# EAGLE design XTIDE-CPLD-3V3-v2 (EAGLE 5.07)
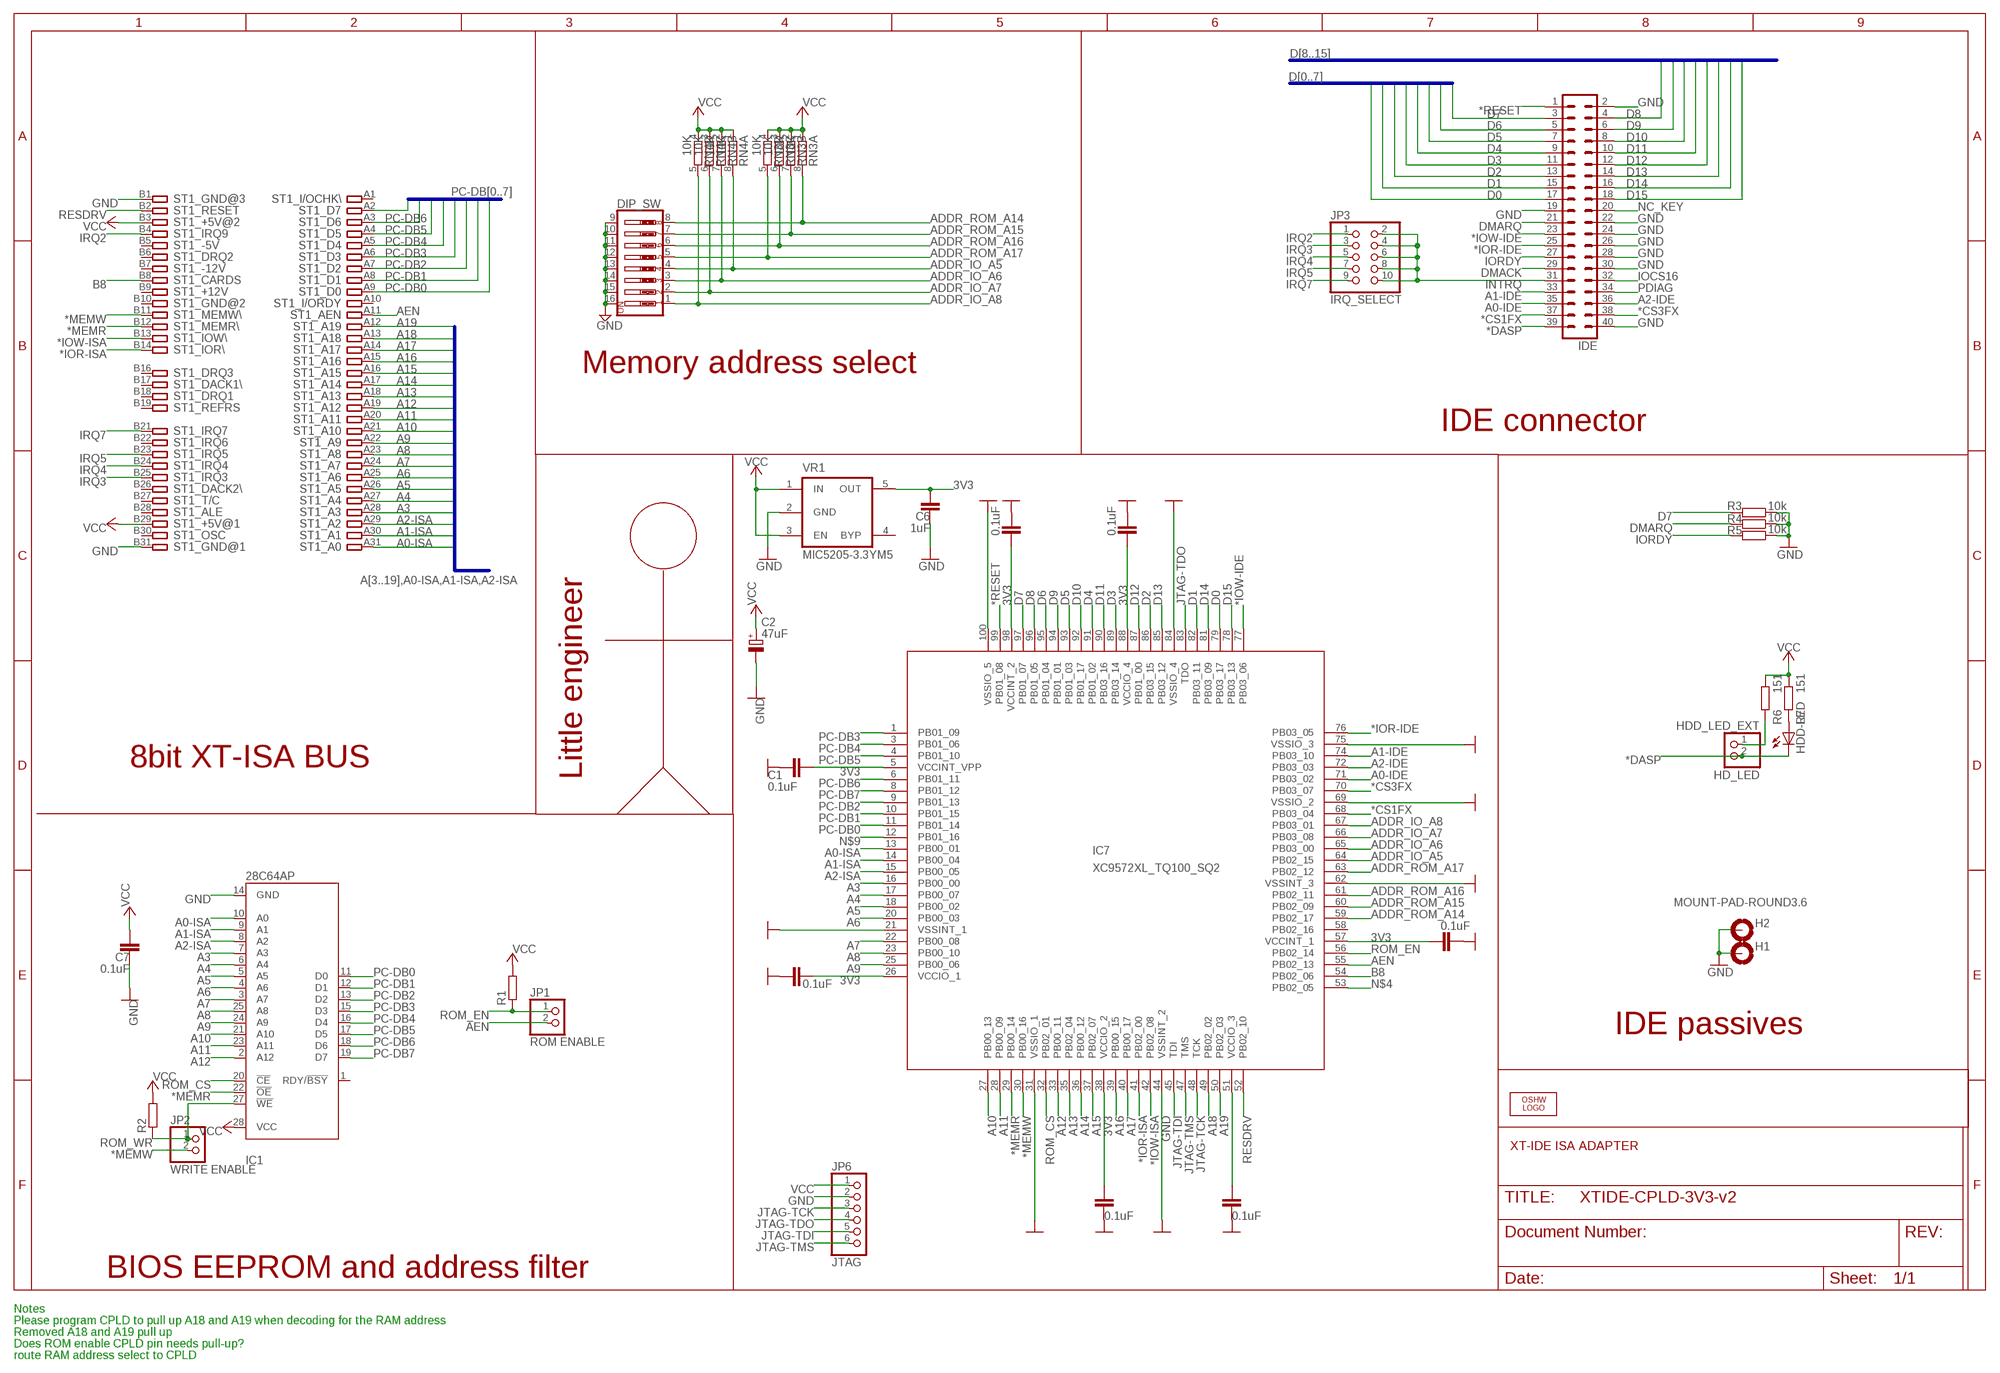
[diagram p0: schematic, sheet 1]

## Parts
C1  0.1uF  C-EUC0603  [C0603]
C2  47uF  CPOL-EUSANYO_SMD_A5  [SANYO-OSCON_SMD_A5]
C3  0.1uF  C-EUC0603  [C0603]
C4  0.1uF  C-EUC0603  [C0603]
C6  1uF  C-EUC0603  [C0603]
C7  0.1uF  C-EUC0603  [C0603]
C8  0.1uF  C-EUC0603  [C0603]
C9  0.1uF  C-EUC0603  [C0603]
C10  0.1uF  C-EUC0603  [C0603]
C11  0.1uF  C-EUC0603  [C0603]
DIP_SW  SW_DIP-8  [EDG-08]
H1  MOUNT-PAD-ROUND3.6  [3,6-PAD]
H2  MOUNT-PAD-ROUND3.6  [3,6-PAD]
HDD-LED  LEDCHIPLED_0805  [CHIPLED_0805]
HDD_LED_EXT  HD_LED  PINHD-1X02_2.54-S  [1X02-S]
IC1  28C64AP  [DIL28-6]
IC7  XC9572XL_TQ100_SQ2  [VQ100]
IDE  MA20-2  [MA20-2]
JP1  ROM ENABLE  PINHD-1X02_2.54-S  [1X02-S]
JP2  WRITE ENABLE  PINHD-1X02_2.54-S  [1X02-S]
JP3  IRQ_SELECT  PINHD-2X05_2.54  [2X05]
JP6  JTAG  PINHD-1X06_2.54-S  [1X06-S]
LOGO1  OSHW_LOGO_10MILX0200-NT  [OSHW_10X200_NOTEXT]
R1  R-EU_R0603  [R0603]
R2  R-EU_R0603  [R0603]
R3  10k  R-EU_R0603  [R0603]
R4  10k  R-EU_R0603  [R0603]
R5  10k  R-EU_R0603  [R0603]
R6  151  R-EU_R0603  [R0603]
R7  151  R-EU_R0603  [R0603]
RN3  10K  RNETWORK  [RN8P-4R-CRA06S]
RN4  10K  RNETWORK  [RN8P-4R-CRA06S]
ST1  IBM8BIT  [IBM8BIT]
VR1  MIC5205-3.3YM5  MIC5205  [SOT-23-5]

## Nets
3V3: C1.2 C3.2 C4.2 C6.2 C8.2 C9.2 C10.2 C11.2 IC7.5(VCCINT_VPP) IC7.26(VCCIO_1) IC7.38(VCCIO_2) IC7.51(VCCIO_3) IC7.57(VCCINT_1) IC7.88(VCCIO_4) IC7.98(VCCINT_2) VR1.5(OUT)
*CS1FX: IC7.68(PB03_04) IDE.37
*CS3FX: IC7.70(PB03_07) IDE.38
*DASP: HDD-LED.C HDD_LED_EXT.2 IDE.39
*IOR-IDE: IC7.76(PB03_05) IDE.25
*IOR-ISA: IC7.41(PB02_00) ST1.B14
*IOW-IDE: IC7.77(PB03_06) IDE.23
*IOW-ISA: IC7.42(PB02_08) ST1.B13
*MEMR: IC1.22(!OE) IC7.29(PB00_14) ST1.B12
*MEMW: IC7.30(PB00_16) JP2.2 ST1.B11
*RESET: IC7.99(PB01_08) IDE.1
A0-IDE: IC7.71(PB03_02) IDE.35
A0-ISA: IC1.10(A0) IC7.13(PB00_01) ST1.A31
A1-IDE: IC7.74(PB03_10) IDE.33
A1-ISA: IC1.9(A1) IC7.14(PB00_04) ST1.A30
A2-IDE: IC7.72(PB03_03) IDE.36
A2-ISA: IC1.8(A2) IC7.15(PB00_05) ST1.A29
A3: IC1.7(A3) IC7.16(PB00_00) ST1.A28
A4: IC1.6(A4) IC7.17(PB00_07) ST1.A27
A5: IC1.5(A5) IC7.18(PB00_02) ST1.A26
A6: IC1.4(A6) IC7.20(PB00_03) ST1.A25
A7: IC1.3(A7) IC7.22(PB00_08) ST1.A24
A8: IC1.25(A8) IC7.23(PB00_10) ST1.A23
A9: IC1.24(A9) IC7.25(PB00_06) ST1.A22
A10: IC1.21(A10) IC7.27(PB00_13) ST1.A21
A11: IC1.23(A11) IC7.28(PB00_09) ST1.A20
A12: IC1.2(A12) IC7.33(PB00_11) ST1.A19
A13: IC7.35(PB02_04) ST1.A18
A14: IC7.36(PB00_12) ST1.A17
A15: IC7.37(PB02_07) ST1.A16
A16: IC7.39(PB00_15) ST1.A15
A17: IC7.40(PB00_17) ST1.A14
A18: IC7.49(PB02_02) ST1.A13
A19: IC7.50(PB02_03) ST1.A12
ADDR_IO_A5: DIP_SW.4 IC7.64(PB02_15) RN4.8
ADDR_IO_A6: DIP_SW.3 IC7.65(PB03_00) RN4.7
ADDR_IO_A7: DIP_SW.2 IC7.66(PB03_08) RN4.6
ADDR_IO_A8: DIP_SW.1 IC7.67(PB03_01) RN4.5
ADDR_ROM_A14: DIP_SW.8 IC7.59(PB02_17) RN3.8
ADDR_ROM_A15: DIP_SW.7 IC7.60(PB02_09) RN3.7
ADDR_ROM_A16: DIP_SW.6 IC7.61(PB02_11) RN3.6
ADDR_ROM_A17: DIP_SW.5 IC7.63(PB02_12) RN3.5
AEN: IC7.55(PB02_13) JP1.2 ST1.A11
B8: IC7.54(PB02_06) ST1.B8
D0: IC7.79(PB03_17) IDE.17
D1: IC7.82(PB03_11) IDE.15
D2: IC7.86(PB03_15) IDE.13
D3: IC7.89(PB03_14) IDE.11
D4: IC7.91(PB01_02) IDE.9
D5: IC7.93(PB01_03) IDE.7
D6: IC7.95(PB01_04) IDE.5
D7: IC7.97(PB01_07) IDE.3 R3.2
D8: IC7.96(PB01_05) IDE.4
D9: IC7.94(PB01_01) IDE.6
D10: IC7.92(PB01_17) IDE.8
D11: IC7.90(PB03_16) IDE.10
D12: IC7.87(PB01_00) IDE.12
D13: IC7.85(PB03_12) IDE.14
D14: IC7.81(PB03_09) IDE.16
D15: IC7.78(PB03_13) IDE.18
DMACK: IDE.29
DMARQ: IDE.21 R4.2
GND: C1.1 C2.- C3.1 C4.1 C6.1 C7.1 C8.1 C9.1 C10.1 C11.1 DIP_SW.9 DIP_SW.10 DIP_SW.11 DIP_SW.12 DIP_SW.13 DIP_SW.14 DIP_SW.15 DIP_SW.16 H1.B3,6(MOUNT) H2.B3,6(MOUNT) IC1.14(GND) IC7.21(VSSINT_1) IC7.31(VSSIO_1) IC7.44(VSSINT_2) IC7.62(VSSINT_3) IC7.69(VSSIO_2) IC7.75(VSSIO_3) IC7.84(VSSIO_4) IC7.100(VSSIO_5) IDE.2 IDE.19 IDE.22 IDE.24 IDE.26 IDE.28 IDE.30 IDE.40 JP6.2 R3.1 R4.1 R5.1 ST1.B1 ST1.B31 VR1.2(GND)
INTRQ: IDE.31 JP3.2 JP3.4 JP3.6 JP3.8 JP3.10
IOCS16: IDE.32
IORDY: IDE.27 R5.2
IRQ2: JP3.1 ST1.B4
IRQ3: JP3.3 ST1.B25
IRQ4: JP3.5 ST1.B24
IRQ5: JP3.7 ST1.B23
IRQ7: JP3.9 ST1.B21
JTAG-TCK: IC7.48(TCK) JP6.3
JTAG-TDI: IC7.45(TDI) JP6.5
JTAG-TDO: IC7.83(TDO) JP6.4
JTAG-TMS: IC7.47(TMS) JP6.6
N$1: HDD-LED.A R7.2
N$4: IC7.53(PB02_05)
N$5: HDD_LED_EXT.1 R6.2
N$9: IC7.12(PB01_16)
NC_KEY: IDE.20
PC-DB0: IC1.11(D0) IC7.11(PB01_14) ST1.A9
PC-DB1: IC1.12(D1) IC7.10(PB01_15) ST1.A8
PC-DB2: IC1.13(D2) IC7.9(PB01_13) ST1.A7
PC-DB3: IC1.15(D3) IC7.1(PB01_09) ST1.A6
PC-DB4: IC1.16(D4) IC7.3(PB01_06) ST1.A5
PC-DB5: IC1.17(D5) IC7.4(PB01_10) ST1.A4
PC-DB6: IC1.18(D6) IC7.6(PB01_11) ST1.A3
PC-DB7: IC1.19(D7) IC7.8(PB01_12) ST1.A2
PDIAG: IDE.34
RESDRV: IC7.52(PB02_10) ST1.B2
ROM_CS: IC1.20(!CE) IC7.32(PB02_01)
ROM_EN: IC7.56(PB02_14) JP1.1 R1.1
ROM_WR: IC1.27(!WE) JP2.1 R2.1
VCC: C2.+ C7.2 IC1.28(VCC) JP6.1 R1.2 R2.2 R6.1 R7.1 RN3.1 RN3.2 RN3.3 RN3.4 RN4.1 RN4.2 RN4.3 RN4.4 ST1.B3 ST1.B29 VR1.1(IN) VR1.3(EN)
Unconnected: IC1.1(RDY/!BSY) IC7.58(PB02_16) ST1.A1 ST1.A10 ST1.B5 ST1.B6 ST1.B7 ST1.B9 ST1.B10 ST1.B15 ST1.B16 ST1.B17 ST1.B18 ST1.B19 ST1.B20 ST1.B22 ST1.B26 ST1.B27 ST1.B28 ST1.B30 VR1.4(BYP)

## Buses
D[0..7]
D[8..15]
PC-DB[0..7]
A[3..19],A0-ISA,A1-ISA,A2-ISA

## Notes on the sheet
- Memory address select
- IDE connector
- 8bit XT-ISA BUS
- Little engineer
- IDE passives
- XT-IDE ISA ADAPTER
- BIOS EEPROM and address filter
- Notes
- Please program CPLD to pull up A18 and A19 when decoding for the RAM address
- Removed A18 and A19 pull up
- Does ROM enable CPLD pin needs pull-up?
- route RAM address select to CPLD

## Library data of the parts
C1 C3 C4 C6-C11 = rcl:C-EU: CAPACITOR, European symbol
C2 = rcl:CPOL-EU: POLARIZED CAPACITOR, European symbol
DIP_SW = special:SW_DIP-8: DIP SWITCH
H1 H2 = holes:MOUNT-PAD-ROUND: MOUNTING PAD, round
HDD-LED = led:LED: LED OSRAM: - CHIPLED LG R971, LG N971, LY N971, LG Q971, LY Q971, LO R971, LY R971 LH N974, LH R974 LS Q976, LO Q976, LY Q976 LO Q996 - Hyper CHIPLED LW Q18S LB Q993, LB Q99A, LB R99A - SideLED LS A670, LO A670, LY A670, LG A670, LP A670 LB A673, LV A673, LT A673, LW A673 LH A674 LY A675 LS A676, LA A676, LO A676, LY A676, LW A676 LS A679, LY A679, LG A679 - Hyper Micro SIDELED® LS Y876, LA Y876, LO Y876, LY Y876 LT Y87S - SmartLED LW L88C, LW L88S LB L89C, LB L89S, LG L890 LS L89K, LO L89K, LY L89K LS L896, LA L896, LO L896, LY L896 - TOPLED LS T670, LO T670, LY T670, LG T670, LP T670 LSG T670, LSP T670, LSY T670, LOP T670, LYG T670 LG T671, LOG T671, LSG T671 LB T673, LV T673, LT T673, LW T673 LH T674 LS T676, LA T676, LO T676, LY T676, LB T676, LH T676, LSB T676, LW T676 LB T67C, LV T67C, LT T67C, LS T67K, LO T67K, LY T67K, LW E67C LS E67B, LA E67B, LO E67B, LY E67B, LB E67C, LV E67C, LT E67C LW T67C LS T679, LY T679, LG T679 LS T770, LO T770, LY T770, LG T770, LP T770 LB T773, LV T773, LT T773, LW T773 LH T774 LS E675, LA E675, LY E675, LS T675 LS T776, LA T776, LO T776, LY T776, LB T776 LHGB T686 LT T68C, LB T68C - Hyper Mini TOPLED® LB M676 - Mini TOPLED Santana® LG M470 LS M47K, LO M47K, LY M47K Source: http://www.osram.convergy.de LUXEON: - LUMILED® LXK2-PW12-R00, LXK2-PW12-S00, LXK2-PW14-U00, LXK2-PW14-V00 LXK2-PM12-R00, LXK2-PM12-S00, LXK2-PM14-U00 LXK2-PE12-Q00, LXK2-PE12-R00, LXK2-PE12-S00, LXK2-PE14-T00, LXK2-PE14-U00 LXK2-PB12-K00, LXK2-PB12-L00, LXK2-PB12-M00, LXK2-PB14-N00, LXK2-PB14-P00, LXK2-PB14-Q00 LXK2-PR12-L00, LXK2-PR12-M00, LXK2-PR14-Q00, LXK2-PR14-R00 LXK2-PD12-Q00, LXK2-PD12-R00, LXK2-PD12-S00 LXK2-PH12-R00, LXK2-PH12-S00 LXK2-PL12-P00, LXK2-PL12-Q00, LXK2-PL12-R00 Source: www.luxeon.com KINGBRIGHT: KA-3528ASYC Source: www.kingbright.com
HDD_LED_EXT JP1 JP2 = pinhead-2:PINHD-1X02: PIN HEADER
IC1 = microchip:28*64A: CMOS EEPROM 64 K (8 K x 8), low voltage
IC7 = dp_devices:XC9572XL_TQ100_SQ2: xc9572xl_tq100 edit this description Auto generated by make-symbol-device-package-bsdl.ulp Rev. 34 Source: xc9572xl_tq100.bsd
IDE = con-lstb:MA20-2: PIN HEADER
JP3 = pinhead-2:PINHD-2X05: PIN HEADER
JP6 = pinhead-2:PINHD-1X06: PIN HEADER
LOGO1 = ohw-logo:OSHW_LOGO_10MIL
R1-R7 = rcl:R-EU_: RESISTOR, European symbol
RN3 RN4 = dp_devices:RNETWORK: 4 Resistor Array 0603
ST1 = con-pc:IBM8BIT: 8-bit CARD IBM/PC-AT
VR1 = dp_devices:MIC5205: 150ma Low-Noise LDO Regulator

## Board
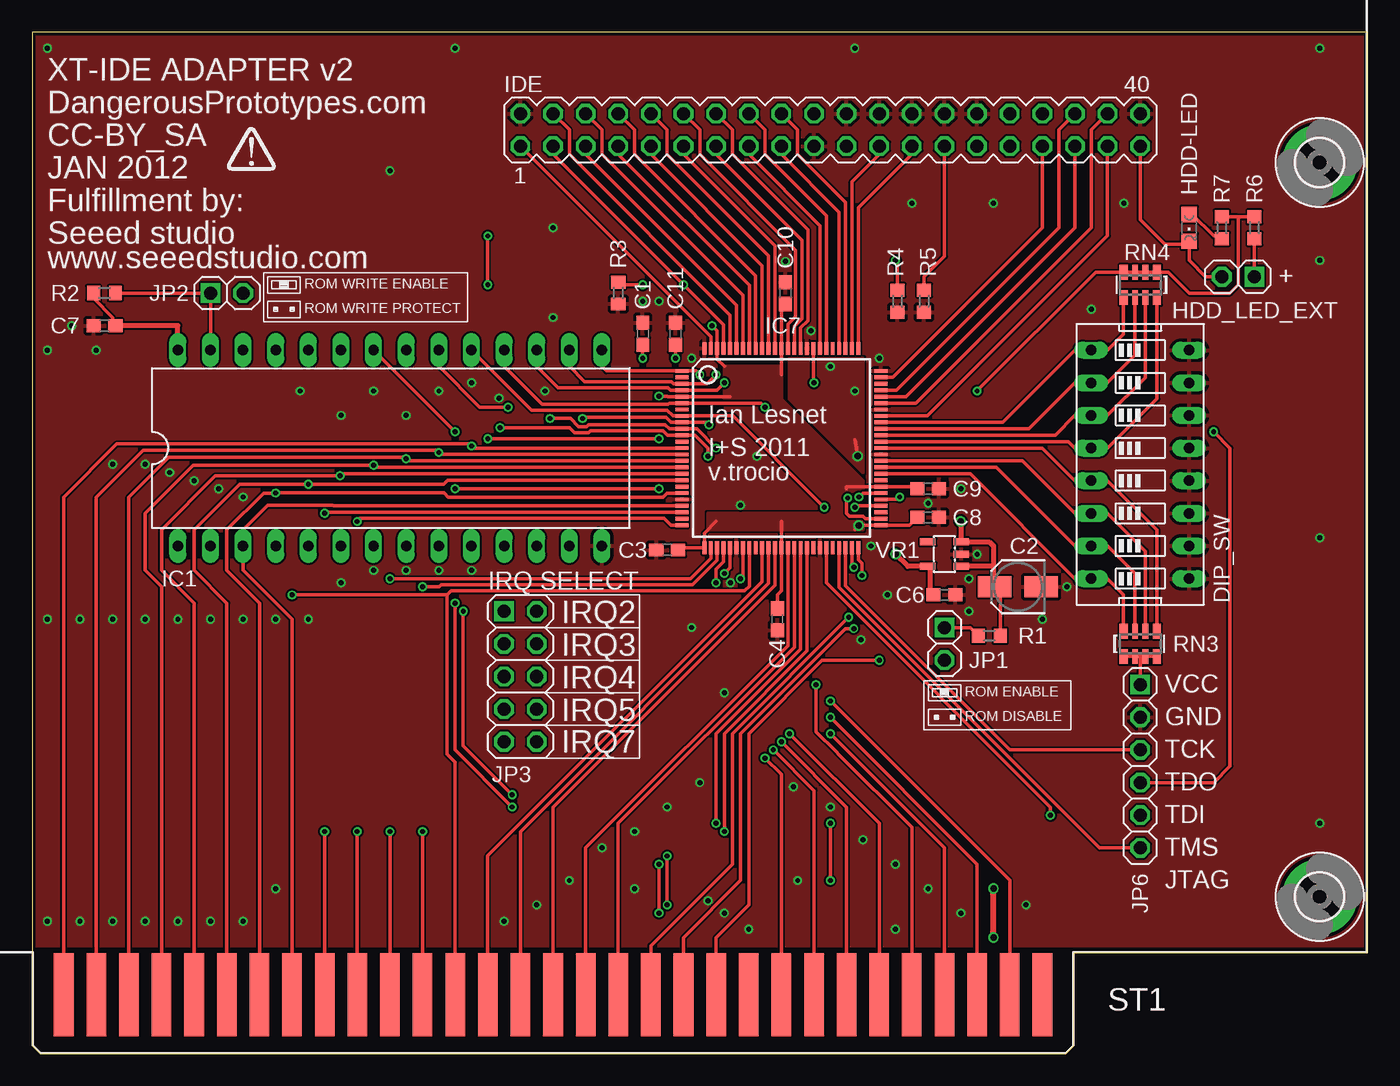
[diagram p1: board, top side]
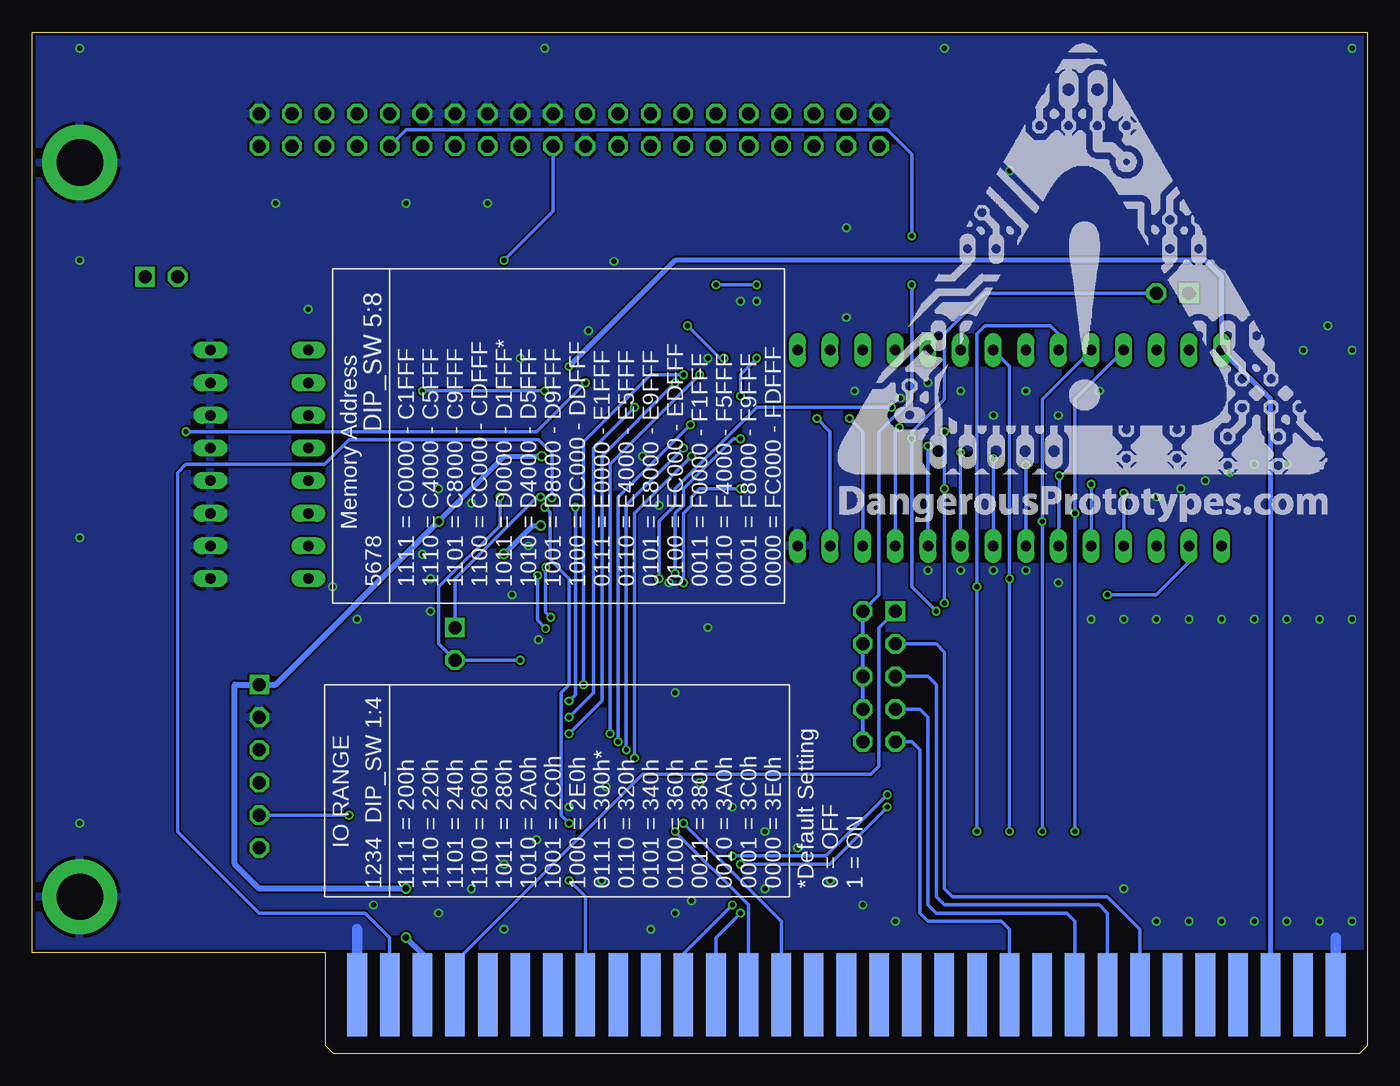
[diagram p2: board, bottom side, seen from below]

Size 103.97 x 79.52 mm. Coordinates in mm from the lower left corner, seen from the top.
Outline: 0,0.79 0,0.63 0.63,0 80.49,0 81.12,0.63 81.12,7.86 103.97,7.86 103.97,79.52 0,79.52 0,0.79
Copper layers (1*16): Top 0.035mm / dielectric 1.5mm / Bottom 0.035mm
Design rules "Fusion_eagle_rule_v1.1": minimum track width 6mil, minimum drill 12mil, track to track 6mil, track to pad 6mil, pad to pad 6mil, via to via 6mil, smd to smd 0mil, copper to edge 10mil, drill to drill 10mil, minimum pad ring 10mil, minimum via ring 6mil, stop-mask expansion 2mil, vias tented up to drill 100mil, thermal gap 10mil

### Footprints (pad centres in the part's own frame; a part is rotated, then mirrored left to right if it is on the bottom)
C0603 = smd 1.1 x 1: 1 -0.85,0; 2 0.85,0
SANYO-OSCON_SMD_A5 = smd 2.6 x 1.6: + 1.8,0; - -1.8,0
EDG-08 = drill 0.813 long: 1 -8.89,-3.81; 2 -6.35,-3.81; 3 -3.81,-3.81; 4 -1.27,-3.81; 5 1.27,-3.81; 6 3.81,-3.81; 7 6.35,-3.81; 8 8.89,-3.81; 9 8.89,3.81; 10 6.35,3.81; 11 3.81,3.81; 12 1.27,3.81; 13 -1.27,3.81; 14 -3.81,3.81; 15 -6.35,3.81; 16 -8.89,3.81
3,6-PAD = drill 3.6 pad 5.842 round: B3,6 0,0
CHIPLED_0805 = smd 1.2 x 1.2: A 0,-1.05; C 0,1.05
1X02-S = drill 1.016 square: 1 -1.27,0 | drill 1.016 octagon: 2 1.27,0
DIL28-6 = drill 0.813 long: 1 -16.51,-7.62; 2 -13.97,-7.62; 3 -11.43,-7.62; 4 -8.89,-7.62; 5 -6.35,-7.62; 6 -3.81,-7.62; 7 -1.27,-7.62; 8 1.27,-7.62; 9 3.81,-7.62; 10 6.35,-7.62; 11 8.89,-7.62; 12 11.43,-7.62; 13 13.97,-7.62; 14 16.51,-7.62; 15 16.51,7.62; 16 13.97,7.62; 17 11.43,7.62; 18 8.89,7.62; 19 6.35,7.62; 20 3.81,7.62; 21 1.27,7.62; 22 -1.27,7.62; 23 -3.81,7.62; 24 -6.35,7.62; 25 -8.89,7.62; 26 -11.43,7.62; 27 -13.97,7.62; 28 -16.51,7.62
VQ100 = smd 1 x 0.3: 1 -7.75,6; 2 -7.75,5.5; 3 -7.75,5; 4 -7.75,4.5; 5 -7.75,4; 6 -7.75,3.5; 7 -7.75,3; 8 -7.75,2.5; 9 -7.75,2; 10 -7.75,1.5; 11 -7.75,1; 12 -7.75,0.5; 13 -7.75,0; 14 -7.75,-0.5; 15 -7.75,-1; 16 -7.75,-1.5; 17 -7.75,-2; 18 -7.75,-2.5; 19 -7.75,-3; 20 -7.75,-3.5; 21 -7.75,-4; 22 -7.75,-4.5; 23 -7.75,-5; 24 -7.75,-5.5; 25 -7.75,-6; 51 7.75,-6; 52 7.75,-5.5; 53 7.75,-5; 54 7.75,-4.5; 55 7.75,-4; 56 7.75,-3.5; 57 7.75,-3; 58 7.75,-2.5; 59 7.75,-2; 60 7.75,-1.5; 61 7.75,-1; 62 7.75,-0.5; 63 7.75,0; 64 7.75,0.5; 65 7.75,1; 66 7.75,1.5; 67 7.75,2; 68 7.75,2.5; 69 7.75,3; 70 7.75,3.5; 71 7.75,4; 72 7.75,4.5; 73 7.75,5; 74 7.75,5.5; 75 7.75,6 | smd 0.3 x 1: 26 -6,-7.75; 27 -5.5,-7.75; 28 -5,-7.75; 29 -4.5,-7.75; 30 -4,-7.75; 31 -3.5,-7.75; 32 -3,-7.75; 33 -2.5,-7.75; 34 -2,-7.75; 35 -1.5,-7.75; 36 -1,-7.75; 37 -0.5,-7.75; 38 0,-7.75; 39 0.5,-7.75; 40 1,-7.75; 41 1.5,-7.75; 42 2,-7.75; 43 2.5,-7.75; 44 3,-7.75; 45 3.5,-7.75; 46 4,-7.75; 47 4.5,-7.75; 48 5,-7.75; 49 5.5,-7.75; 50 6,-7.75; 76 6,7.75; 77 5.5,7.75; 78 5,7.75; 79 4.5,7.75; 80 4,7.75; 81 3.5,7.75; 82 3,7.75; 83 2.5,7.75; 84 2,7.75; 85 1.5,7.75; 86 1,7.75; 87 0.5,7.75; 88 0,7.75; 89 -0.5,7.75; 90 -1,7.75; 91 -1.5,7.75; 92 -2,7.75; 93 -2.5,7.75; 94 -3,7.75; 95 -3.5,7.75; 96 -4,7.75; 97 -4.5,7.75; 98 -5,7.75; 99 -5.5,7.75; 100 -6,7.75
MA20-2 = drill 1.016 octagon: 1 -24.13,-1.27; 2 -24.13,1.27; 3 -21.59,-1.27; 4 -21.59,1.27; 5 -19.05,-1.27; 6 -19.05,1.27; 7 -16.51,-1.27; 8 -16.51,1.27; 9 -13.97,-1.27; 10 -13.97,1.27; 11 -11.43,-1.27; 12 -11.43,1.27; 13 -8.89,-1.27; 14 -8.89,1.27; 15 -6.35,-1.27; 16 -6.35,1.27; 17 -3.81,-1.27; 18 -3.81,1.27; 19 -1.27,-1.27; 20 -1.27,1.27; 21 1.27,-1.27; 22 1.27,1.27; 23 3.81,-1.27; 24 3.81,1.27; 25 6.35,-1.27; 26 6.35,1.27; 27 8.89,-1.27; 28 8.89,1.27; 29 11.43,-1.27; 30 11.43,1.27; 31 13.97,-1.27; 32 13.97,1.27; 33 16.51,-1.27; 34 16.51,1.27; 35 19.05,-1.27; 36 19.05,1.27; 37 21.59,-1.27; 38 21.59,1.27; 39 24.13,-1.27; 40 24.13,1.27
2X05 = drill 1.016 square: 1 -5.08,-1.27 | drill 1.016 octagon: 2 -5.08,1.27; 3 -2.54,-1.27; 4 -2.54,1.27; 5 0,-1.27; 6 0,1.27; 7 2.54,-1.27; 8 2.54,1.27; 9 5.08,-1.27; 10 5.08,1.27
1X06-S = drill 1.016 square: 1 -6.35,0 | drill 1.016 octagon: 2 -3.81,0; 3 -1.27,0; 4 1.27,0; 5 3.81,0; 6 6.35,0
R0603 = smd 1 x 1.1: 1 -0.85,0; 2 0.85,0
RN8P-4R-CRA06S = smd 0.63 x 1.15: 1 -1.295,-0.975; 4 1.295,-0.975; 5 1.295,0.975; 8 -1.295,0.975 | smd 0.44 x 1.15: 2 -0.4,-0.975; 3 0.4,-0.975; 6 0.4,0.975; 7 -0.4,0.975
IBM8BIT = smd 1.524 x 6.477: A1 -25.4,5.08; A2 -27.94,5.08; A3 -30.48,5.08; A4 -33.02,5.08; A5 -35.56,5.08; A6 -38.1,5.08; A7 -40.64,5.08; A8 -43.18,5.08; A9 -45.72,5.08; A10 -48.26,5.08; A11 -50.8,5.08; A12 -53.34,5.08; A13 -55.88,5.08; A14 -58.42,5.08; A15 -60.96,5.08; A16 -63.5,5.08; A17 -66.04,5.08; A18 -68.58,5.08; A19 -71.12,5.08; A20 -73.66,5.08; A21 -76.2,5.08; A22 -78.74,5.08; A23 -81.28,5.08; A24 -83.82,5.08; A25 -86.36,5.08; A26 -88.9,5.08; A27 -91.44,5.08; A28 -93.98,5.08; A29 -96.52,5.08; A30 -99.06,5.08; A31 -101.6,5.08 | smd 1.524 x 6.477 bottom: B1 -25.4,5.08; B2 -27.94,5.08; B3 -30.48,5.08; B4 -33.02,5.08; B5 -35.56,5.08; B6 -38.1,5.08; B7 -40.64,5.08; B8 -43.18,5.08; B9 -45.72,5.08; B10 -48.26,5.08; B11 -50.8,5.08; B12 -53.34,5.08; B13 -55.88,5.08; B14 -58.42,5.08; B15 -60.96,5.08; B16 -63.5,5.08; B17 -66.04,5.08; B18 -68.58,5.08; B19 -71.12,5.08; B20 -73.66,5.08; B21 -76.2,5.08; B22 -78.74,5.08; B23 -81.28,5.08; B24 -83.82,5.08; B25 -86.36,5.08; B26 -88.9,5.08; B27 -91.44,5.08; B28 -93.98,5.08; B29 -96.52,5.08; B30 -99.06,5.08; B31 -101.6,5.08
SOT-23-5 = smd 0.55 x 1.2: 1 -0.95,-1.3; 2 0,-1.3; 3 0.95,-1.3; 4 0.95,1.3; 5 -0.95,1.3

### Placement (x,y rotation side)
C1  47.55,56.04 270 top
C2  76.76,36.35 180 top
C3  49.45,39.21 0 top
C4  58.02,33.81 90 top
C6  71.04,35.72 180 top
C7  5.64,56.67 0 top
C8  69.77,41.75 180 top
C9  69.77,43.97 180 top
C10  58.66,59.21 270 top
C11  50.09,56.04 270 top
DIP_SW  86.28,45.88 270 top
H1  100.25,12.22 0 top
H2  100.25,69.37 0 top
HDD-LED  90.09,64.29 180 top
HDD_LED_EXT  93.9,60.48 180 top
IC1  27.86,47.15 0 top
IC7  58.34,47.15 0 top
IDE  62.15,71.91 0 top
JP1  71.04,31.91 270 top
JP2  15.16,59.21 0 top
JP3  38.02,29.37 270 top
JP6  86.28,22.38 270 top
R1  74.53,32.54 0 top
R2  5.64,59.21 180 top
R3  45.64,59.21 90 top
R4  67.39,58.58 90 top
R5  69.45,58.58 90 top
R6  95.17,64.29 270 top
R7  92.63,64.29 270 top
RN3  86.28,31.91 0 top
RN4  86.28,59.85 180 top
ST1  104.06,-0.48 0 top
U$1  [DP-LOGO_TOP]  15.16,68.74 0 top
U$3  [JUMP2_DESC_ON]  19.61,59.85 0 top
U$4  [JUMP2_DESC_OFF]  19.61,57.94 0 top
U$5  [DP_LOGO_ART_1.5X1.5]  41.2,41.43 0 bottom
U$6  [JUMP2_DESC_ON]  71.04,28.1 0 top
U$7  [JUMP2_DESC_OFF]  71.04,26.19 0 top
VR1  71.04,38.89 90 top

### Tracks (layer width: path | path; a pad name or v marks a point on that pad's centre or on a via)
3V3  (via drill 0.38, 0.51)
  Top 0.254: 53.9,53.5 53.34,54.05 IC7.98 53.34,56.28 v52.94,56.67 | 54.34,51.15 IC7.5 49.5,51.15 49.45,51.2 v48.82,51.2 | C11.2 v50.09,54.13 | C1.2 v47.55,54.13 | 58.34,41.43 IC7.38 58.34,36.04 58.02,35.72 C4.2 | 64.06,40.8 64.41,41.15 IC7.51 68.32,41.15 C8.2 68.82,41.75 | 53.26,41.43 52.34,40.51 IC7.26 50.49,39.4 C3.2 | 63.42,43.97 63.42,44.15 IC7.57 68.75,44.15 C9.2 | 58.34,52.86 IC7.88 58.34,58.05 C10.2
  Top 0.406: v67.23,38.89 68.18,37.94 VR1.5 69.93,37.75 69.93,35.72 C6.2
  Bottom 0.254: v50.09,54.13 50.4,54.13 v52.94,56.67 | v48.82,51.2 48.82,52.86 v47.55,54.13
  Bottom 0.406: v67.23,38.89 65.01,41.12 v64.37,41.12
  pour Top: 53.9,53.5 58.34,53.5 58.34,50.96 64.69,44.61 64.69,40.8 52.63,40.8 52.63,42.07 61.52,42.07 61.52,42.7 53.9,50.32
*CS1FX
  Top 0.254: IC7.68 69.73,49.65 83.74,63.66 IDE.37
*CS3FX
  Top 0.254: IDE.38 82.47,71.91 82.47,64.29 68.83,50.65 IC7.70
*DASP
  Top 0.254: IDE.39 86.28,64.93 88.19,63.02 89.87,63.02 HDD-LED.C 90.09,61.75 91.36,60.48 HDD_LED_EXT.2
*IOR-IDE
  Top 0.254: IC7.76 64.34,65.85 68.5,70.01 IDE.25
*IOR-ISA  (via drill 0.38)
  Top 0.254: IC7.41 59.84,31.5 53.26,24.92 v53.26,17.94
  Bottom 0.254: ST1.B14 45.64,10.32 v53.26,17.94
*IOW-IDE
  Top 0.254: IC7.77 63.84,67.89 65.96,70.01 IDE.23
*IOW-ISA  (via drill 0.38)
  Top 0.254: IC7.42 60.34,31.37 53.9,24.92 v53.9,17.3
  Bottom 0.254: ST1.B13 48.18,11.59 v53.9,17.3
*MEMR  (via drill 0.38)
  Top 0.254: v32.94,48.42 IC1.22 | v32.94,35.08 32.94,23.65 v37.39,19.21 | v48.82,14.76 v48.82,10.95 | v32.94,43.97 v48.82,43.97 | v53.26,36.67 53.26,37.7 53.84,38.28 IC7.29
  Bottom 0.254: v32.94,35.08 v32.94,43.97 v32.94,48.42 | v48.82,10.95 50.72,9.05 ST1.B12 | v48.82,14.76 41.83,14.76 v37.39,19.21 | 51.99,43.97 | v48.82,43.97 51.99,43.97 | 51.99,43.97 52.63,43.34 52.63,42.7 53.26,42.07 v53.26,36.67
*MEMW  (via drill 0.38)
  Top 0.254: v49.45,15.4 v49.45,11.59 | v33.58,34.45 33.58,23.97 v37.39,20.16 | v35.48,47.86 v48.82,47.86 | IC7.30 54.34,37.83 v53.9,37.39
  Bottom 0.254: JP2.2 29.77,59.21 32.94,56.04 32.94,50.96 35.48,48.42 v35.48,47.86 35.48,36.35 v33.58,34.45 | ST1.B11 53.26,7.78 v49.45,11.59 | v49.45,15.4 42.15,15.4 v37.39,20.16 | v48.82,47.86 49.37,47.86 53.26,43.97 53.26,42.7 53.9,42.07 v53.9,37.39
*RESET
  Top 0.254: IC7.99 52.84,55.82 IDE.1
A0-IDE
  Top 0.254: IC7.71 68.06,51.15 81.2,64.29 IDE.35
A0-ISA  (via drill 0.38)
  Top 0.254: IC7.13 34.37,47.15 v34.21,47.31 | v34.21,47.31 | v34.21,47.31 34.05,47.47 6.59,47.47 2.46,43.34 ST1.A31
  Bottom 0.254: v34.21,47.31 IC1.10
A1-IDE
  Top 0.254: IDE.33 78.66,64.29 67.02,52.65 IC7.74
A1-ISA  (via drill 0.38)
  Top 0.254: IC7.14 31.83,46.65 v31.67,46.81 31.49,46.99 8.65,46.99 5,43.34 ST1.A30
  Bottom 0.254: v31.67,46.81 IC1.9
A2-IDE
  Top 0.254: IDE.36 79.93,71.91 79.93,64.29 67.29,51.65 IC7.72
A2-ISA  (via drill 0.38)
  Top 0.254: IC7.15 29.29,46.15 v29.13,46.31 29,46.43 10.64,46.43 7.54,43.34 ST1.A29
  Bottom 0.254: v29.13,46.31 IC1.8
A3  (via drill 0.38)
  Top 0.254: ST1.A28 10.08,36.35 8.81,37.62 8.81,42.07 12.55,45.81 v26.59,45.81 26.75,45.65 IC7.16
  Bottom 0.254: v26.59,45.81 IC1.7
A4  (via drill 0.38)
  Top 0.254: ST1.A27 12.62,35.08 10.08,37.62 10.08,40.8 14.27,44.99 v23.97,44.99 24.13,45.15 IC7.17
  Bottom 0.254: v23.97,44.99 IC1.6
A5  (via drill 0.38)
  Top 0.254: ST1.A26 15.16,35.08 12.62,37.62 12.62,40.8 16.15,44.33 v21.51,44.33 32.03,44.33 32.35,44.65 IC7.18
  Bottom 0.254: v21.51,44.33 IC1.5
A6  (via drill 0.38)
  Top 0.254: ST1.A25 17.7,35.08 15.16,37.62 15.16,40.8 18.01,43.65 v18.97,43.65 18.98,43.66 32.07,43.66 32.38,43.34 49.13,43.34 49.44,43.65 IC7.20
  Bottom 0.254: v18.97,43.65 IC1.4
A7
  Top 0.254: ST1.A24 20.24,33.81 16.43,37.62 IC1.3 16.43,40.8 18.34,42.7 23.42,42.7 23.47,42.65 IC7.22
A8  (via drill 0.38)
  Top 0.254: ST1.A23 v22.78,17.3 | IC7.23 22.86,42.15 v22.78,42.07
  Bottom 0.254: v22.78,17.3 v22.78,42.07 22.78,50.96 IC1.25
A9  (via drill 0.38)
  Top 0.254: ST1.A22 v25.32,17.3 | IC7.25 49.74,41.15 49.45,41.43 | 49.45,41.43 | 49.29,41.59 49.45,41.43 | 49.29,41.59 | 49.29,41.59 49.21,41.67 25.56,41.67 v25.32,41.43
  Bottom 0.254: v25.32,17.3 v25.32,41.43 25.32,50.96 IC1.24
A10  (via drill 0.38)
  Top 0.254: ST1.A21 v27.86,17.3 | IC7.27 52.84,38.55 51.28,36.99 v27.86,36.99
  Bottom 0.254: v27.86,17.3 v27.86,36.99 27.86,53.5 IC1.21
A11  (via drill 0.38)
  Top 0.254: ST1.A20 v30.4,17.3 | IC7.28 53.34,38.42 51.43,36.51 31.83,36.51 31.67,36.35 v30.4,36.35
  Bottom 0.254: v30.4,17.3 v30.4,36.35 30.4,56.04 29.77,56.67 24.69,56.67 24.05,56.04 IC1.23
A12  (via drill 0.38)
  Top 0.254: IC7.33 55.84,36.39 55.48,36.04 32.62,36.04 32.31,35.72 | ST1.A19 32.94,22.7 32.31,23.34 32.31,35.72 | 32.31,35.72 v20.24,35.72 | 32.31,35.72
  Bottom 0.254: IC1.2 13.89,38.26 16.43,35.72 v20.24,35.72
A13
  Top 0.254: IC7.35 56.84,36.76 35.48,15.4 ST1.A18
A14
  Top 0.254: IC7.36 57.34,36.62 38.02,17.3 ST1.A17
A15
  Top 0.254: IC7.37 57.84,36.49 40.56,19.21 ST1.A16
A16
  Top 0.254: ST1.A15 43.1,16.03 58.84,31.77 IC7.39
A17
  Top 0.254: ST1.A14 45.64,17.94 59.34,31.64 IC7.40
A18  (via drill 0.38)
  Top 0.254: v63.58,33.97 54.53,24.92 54.53,14.76 48.18,8.41 ST1.A13 | IC7.49 63.84,38 v63.98,37.86
  Bottom 0.254: v63.98,37.86 63.98,34.37 v63.58,33.97
A19  (via drill 0.38)
  Top 0.254: ST1.A12 50.72,9.05 55.17,13.49 55.17,24.92 63.34,33.1 v63.98,33.1 | IC7.50 64.34,38.45 64.61,38.18 v64.61,37.23
  Bottom 0.254: v64.61,37.23 64.61,33.73 v63.98,33.1
ADDR_IO_A5
  Top 0.254: RN4.8 87.58,50.98 83.74,47.15 DIP_SW.4 81.2,47.15 80.7,47.65 IC7.64
ADDR_IO_A6
  Top 0.254: RN4.7 86.68,52.63 83.74,49.69 DIP_SW.3 81.2,49.69 79.66,48.15 IC7.65
ADDR_IO_A7
  Top 0.254: RN4.6 85.88,54.37 83.74,52.23 DIP_SW.2 81.2,52.23 77.62,48.65 IC7.66
ADDR_IO_A8
  Top 0.254: RN4.5 84.99,56.01 83.74,54.77 DIP_SW.1 81.2,54.77 75.58,49.15 IC7.67
ADDR_ROM_A14
  Top 0.254: RN3.8 84.99,35.74 83.74,36.99 DIP_SW.8 81.2,36.99 73.04,45.15 IC7.59
ADDR_ROM_A15
  Top 0.254: RN3.7 85.88,37.39 83.74,39.53 DIP_SW.7 81.2,39.53 75.08,45.65 IC7.60
ADDR_ROM_A16
  Top 0.254: RN3.6 86.68,39.13 83.74,42.07 DIP_SW.6 81.2,42.07 77.12,46.15 IC7.61
ADDR_ROM_A17
  Top 0.254: RN3.5 87.58,40.77 83.74,44.61 DIP_SW.5 81.2,44.61 78.66,47.15 IC7.63
AEN  (via drill 0.38)
  Top 0.254: ST1.A11 53.26,9.05 55.8,11.59 55.8,24.92 61.52,30.64 v65.96,30.64 | IC7.55 67.36,43.15 v67.55,43.34
  Bottom 0.254: v67.55,43.34 67.55,41.12 72.31,36.35 72.31,31.91 JP1.2 v65.96,30.64
B8  (via drill 0.38)
  Top 0.254: v62.15,13.49 v62.15,17.94 | IC7.54 64.16,42.65 v64.06,42.54
  Bottom 0.254: ST1.B8 60.88,12.22 v62.15,13.49 | v64.06,42.54 63.66,42.15 63.66,38.5 62.15,36.99 62.15,28.73 62.79,28.1 62.79,18.57 v62.15,17.94
D0
  Top 0.254: IC7.79 62.84,65.51 58.34,70.01 IDE.17
D1
  Top 0.254: IC7.82 61.34,64.47 55.8,70.01 IDE.15
D2
  Top 0.254: IDE.13 53.26,70.01 59.93,63.34 59.93,57.23 59.34,56.64 IC7.86
D3
  Top 0.254: IDE.11 50.72,70.01 57.84,62.89 IC7.89
D4
  Top 0.254: IDE.9 48.18,70.01 56.84,61.35 IC7.91
D5
  Top 0.254: IC7.93 55.84,59.81 45.64,70.01 IDE.7
D6
  Top 0.254: IC7.95 54.84,58.27 43.1,70.01 IDE.5
D7  (via drill 0.38)
  Top 0.254: IC7.97 53.84,56.73 v50.72,59.85 40.56,70.01 IDE.3 | v47.55,59.85 45.86,59.85 R3.2
  Bottom 0.254: v47.55,59.85 v50.72,59.85
D8
  Top 0.254: IDE.4 41.83,71.91 41.83,70.01 54.34,57.5 IC7.96
D9
  Top 0.254: IDE.6 44.37,71.91 44.37,70.01 55.34,59.04 IC7.94
D10
  Top 0.254: IDE.8 46.91,71.91 46.91,70.01 56.34,60.58 IC7.92
D11
  Top 0.254: IDE.10 49.45,71.91 49.45,70.01 57.34,62.12 IC7.90
D12
  Top 0.254: IDE.12 51.99,71.91 51.99,70.01 59.45,62.55 59.45,57.39 58.84,56.78 | IC7.87 58.84,56.78 | 58.84,56.78
D13
  Top 0.254: IDE.14 54.53,71.91 54.53,70.01 60.4,64.13 60.4,57.07 59.84,56.51 IC7.85
D14
  Top 0.254: IDE.16 57.07,71.91 57.07,70.01 61.84,65.24 IC7.81
D15
  Top 0.254: IDE.18 59.61,71.91 59.61,70.01 63.34,66.28 IC7.78
DMARQ  (via drill 0.38)
  Top 0.254: R4.2 67.39,61.59 v67.23,61.75
  Bottom 0.254: v67.23,61.75 63.42,65.56 IDE.21
GND  (via drill 0.38)
  Bottom 0.813: ST1.B1 78.66,9.68 | ST1.B31 2.46,9.05
  other vias: 60.64,56.28 55.17,42.7 53.9,28.1 51.36,33.18 54.37,36.67 52.63,11.91 64.53,32.23 59.29,20.8 62.15,19.21 59.61,13.49 64.69,16.67 67.23,14.76 69.77,12.86 67.23,9.68 77.39,11.59 72.31,10.95 58.66,61.67 55.8,9.68 53.9,10.95 51.99,21.11 49.45,19.21 46.91,17.3 46.91,12.86 44.37,16.03 41.83,13.49 39.29,11.59 36.75,10.32 56.44,46.51 39.93,51.59 36.35,51.04 31.67,51.59 29.13,49.69 26.59,51.59 24.05,49.69 20.88,51.59 34.21,52.23 1.19,10.32 1.19,33.81 1.19,54.77 1.19,78.26 32.94,78.26 64.06,78.26 100.25,78.26 100.25,17.94 100.25,40.16 100.25,61.75 3.73,10.32 6.27,10.32 8.81,10.32 11.35,10.32 13.89,10.32 16.43,10.32 18.97,12.86 18.97,33.81 16.43,33.81 13.89,33.81 11.35,33.81 8.81,33.81 6.27,33.81 6.27,45.88 3.73,33.81 8.81,45.88 10.72,45.24 12.62,44.61 14.53,43.97 16.43,43.34 78.66,33.81 80.57,36.35 72.31,43.97 69.77,42.86 47.55,58.58 48.82,58.58 3.1,56.67 5,54.77 40.56,57.31 40.56,64.29 27.86,68.74 74.85,66.2 68.5,66.2 65.96,54.13 82.47,57.94 85.01,66.2 51.36,54.13 65.33,39.53 21.51,33.81 24.05,36.67 26.59,37.62 29.13,37.62 31.67,37.62 34.21,37.62 72.95,36.99 72.95,34.45 73.58,38.89 66.6,35.72
  pour Top (rank 6): -0.08,79.53 105.97,79.53 105.97,8.41 -0.08,8.41
  pour Bottom: -0.08,79.53 106.6,79.53 106.6,8.41 -0.08,8.41
INTRQ  (via drill 0.38)
  Top 0.254: v35.48,59.85 v35.48,63.66
  Bottom 0.254: JP3.2 38.02,35.72 38.02,48.42 35.48,50.96 v35.48,59.85 | IDE.31 74.85,71.91 37.39,71.91 35.48,70.01 v35.48,63.66
  Bottom 0.305: JP3.2 JP3.4 JP3.6 JP3.8 JP3.10
IORDY
  Top 0.254: IDE.27 71.04,62.07 69.45,60.48 R5.2
IRQ2
  Bottom 0.254: ST1.B4 71.04,7.14 56.44,21.75 38.66,21.75 38.02,22.38 38.02,33.18 JP3.1
IRQ3
  Bottom 0.254: ST1.B25 17.7,9.68 20.24,12.22 32.31,12.22 32.94,12.86 32.94,31.27 33.58,31.91 JP3.3
IRQ4
  Bottom 0.254: ST1.B24 20.24,10.95 20.88,11.59 32.94,11.59 33.58,12.22 33.58,28.73 34.21,29.37 JP3.5
IRQ5
  Bottom 0.254: ST1.B23 22.78,10.32 23.42,10.95 33.58,10.95 34.21,11.59 34.21,26.19 34.85,26.83 JP3.7
IRQ7
  Bottom 0.254: ST1.B21 27.86,9.68 28.5,10.32 34.21,10.32 34.85,10.95 34.85,23.65 35.48,24.29 JP3.9
JTAG-TCK
  Top 0.254: JP6.3 76.12,23.65 63.34,36.43 IC7.48
JTAG-TDI  (via drill 0.38)
  Top 0.254: IC7.45 61.84,36.66 79.3,19.21 v79.3,18.57
  Bottom 0.254: v79.3,18.57 JP6.5
JTAG-TDO  (via drill 0.38)
  Top 0.254: IC7.83 60.84,52.27 v60.88,52.23 | JP6.4 92,21.11 93.27,22.38 93.27,47.15 v92,48.42
  Bottom 0.254: v92,48.42 64.69,48.42 v60.88,52.23
JTAG-TMS
  Top 0.254: IC7.47 62.84,36.3 83.11,16.03 JP6.6
N$1
  Top 0.254: HDD-LED.A 90.31,65.34 92,63.66 92.42,63.66 R7.2
N$5
  Top 0.254: HDD_LED_EXT.1 R6.2
PC-DB0  (via drill 0.38)
  Top 0.254: v52.63,46.51 52.63,47.15 51.63,48.15 IC7.11 49.48,48.15 49.13,48.5 43.5,48.5 43.34,48.34 42.23,48.34 41.83,48.74 v36.43,48.74 | ST1.A9 58.34,21.75 v57.07,23.02
  Bottom 0.254: v57.07,23.02 57.07,42.07 v52.63,46.51 | IC1.11 36.75,48.42 v36.43,48.74
PC-DB1  (via drill 0.38)
  Top 0.254: v53.26,47.15 51.76,48.65 IC7.10 49.62,48.65 49.29,48.97 43.34,48.97 43.18,48.82 42.54,48.82 41.91,49.45 v40.32,49.45 | ST1.A8 60.88,20.48 v57.71,23.65
  Bottom 0.254: IC1.12 39.29,48.42 v40.32,49.45 | v57.71,23.65 57.71,42.7 v53.26,47.15
PC-DB2  (via drill 0.38)
  Top 0.254: v52.7,48.97 52.53,49.15 IC7.9 49.75,49.15 49.37,49.53 42.94,49.53 v42.86,49.45 | ST1.A7 63.42,19.21 v58.34,24.29
  Bottom 0.254: IC1.13 41.83,48.42 v42.86,49.45 | v58.34,24.29 58.34,43.34 v52.7,48.97
PC-DB3  (via drill 0.38)
  Top 0.254: IC1.15 44.37,53.5 44.72,53.15 IC7.1 51.71,53.15 v51.99,52.86 | ST1.A6 65.96,17.94 v58.98,24.92
  Bottom 0.254: v58.98,24.92 58.98,45.88 v51.99,52.86
PC-DB4  (via drill 0.38)
  Top 0.254: IC1.16 41.83,53.5 43.02,52.31 49.77,52.31 49.93,52.15 IC7.3 52.55,52.15 v53.26,52.86 | v61.04,28.73 61.04,25.08 62.63,23.49 62.79,23.34 68.5,17.62 ST1.A5
  Bottom 0.254: v53.26,52.86 55.8,52.86 61.04,47.62 v61.04,28.73
PC-DB5  (via drill 0.38)
  Top 0.254: IC1.17 39.29,53.5 40.96,51.83 49.53,51.83 49.61,51.75 | v53.9,52.23 53.32,51.65 IC7.4 49.71,51.65 49.61,51.75 | 49.61,51.75 | ST1.A4 71.04,16.03 v62.15,24.92
  Bottom 0.254: v53.9,52.23 59.61,46.51 59.61,27.46 v62.15,24.92
PC-DB6  (via drill 0.38)
  Top 0.254: IC1.18 36.75,53.5 39.69,50.56 49.53,50.56 49.62,50.65 IC7.6 56.75,50.65 v57.07,50.32 | ST1.A3 73.58,14.76 v62.15,26.19
  Bottom 0.254: v57.07,50.32 60.25,47.15 60.25,28.1 v62.15,26.19
PC-DB7  (via drill 0.38)
  Top 0.254: v61.67,42.54 61.2,43.02 54.57,49.65 IC7.8 49.89,49.65 49.45,50.09 38.89,50.09 IC1.19 | ST1.A2 76.12,13.49 v62.15,27.46
  Bottom 0.254: v61.67,42.54 61.67,27.94 v62.15,27.46
RESDRV  (via drill 0.38)
  Top 0.254: v63.5,43.26 63.42,43.18 63.42,42.07 63.66,41.83 64.69,41.83 64.87,41.65 IC7.52
  Bottom 0.254: ST1.B2 76.12,9.05 78.03,10.95 86.28,10.95 92.63,17.3 92.63,45.24 92,45.88 81.2,45.88 79.3,47.78 64.53,47.78 63.5,46.75 v63.5,43.26
ROM_CS  (via drill 0.38)
  Top 0.254: IC1.20 31.67,53.5 34.85,50.32 v37.07,50.32 | IC7.32 55.34,37.16 v55.17,36.99
  Bottom 0.254: v37.07,50.32 47.55,50.32 53.9,43.97 53.9,42.7 55.17,41.43 v55.17,36.99
ROM_EN  (via drill 0.38)
  Top 0.254: JP1.1 73.05,33.18 R1.1 | IC7.56 64.68,43.65 v64.37,43.34
  Bottom 0.254: v64.37,43.34 64.69,43.34 71.04,36.99 JP1.1
ROM_WR
  Top 0.254: IC1.27 JP2.1 R2.1
VCC  (via drill 0.38, 0.51)
  Top 0.254: RN3.4 RN3.3 RN3.2 RN3.1 86.22,30.93 86.28,30.88 JP6.1 | v64.29,46.51 64.06,47.78 | R1.2 75.38,36.25 75.49,36.35 C2.+ | C7.2 6.27,56.89 6.27,57.31 4.79,58.79 R2.2 5,59.43 | R6.1 R7.1 93.84,65.14 93.9,65.09 93.9,59.85 93.27,59.21 90.09,59.21 88.48,60.82 RN4.1 RN4.2 RN4.3 RN4.4 82.81,60.82 v73.58,51.59
  Top 0.406: v72.31,41.43 72.31,39.87 VR1.3 74.54,39.84 74.85,39.53 74.85,37.94 | 74.85,37.94 74.85,37.09 C2.+ | VR1.1 72.47,37.94 74.85,37.94 | IC1.28 11.35,56.67 C7.2
  Top 0.457: v74.85,9.05 v74.85,12.86
  Bottom 0.254: v64.06,51.59 v73.58,51.59
  Bottom 0.406: v64.29,46.51 67.23,46.51 v72.31,41.43 | v62.15,53.5 53.9,61.75 12.62,61.75 11.35,60.48 IC1.28 7.54,50.96 ST1.B29
  Bottom 0.457: ST1.B3 73.58,7.78 v74.85,9.05 | v74.85,12.86 86.28,12.86 88.19,14.76 88.19,28.73 JP6.1 85.01,28.73 v72.31,41.43
  pour Top: 58.98,54.13 64.69,54.13 64.69,45.24 59.61,50.32 58.98,50.96

### Text on the board
tPlace: XT-IDE ADAPTER v2 | DangerousPrototypes.com | CC-BY_SA | JAN 2012 | Fulfillment by: | Seeed studio | www.seeedstudio.com | + | Ian Lesnet | I+S 2011 | v.trocio | IRQ SELECT | IRQ2 | IRQ3 | IRQ4 | IRQ5 | IRQ7
bPlace: DIP_SW 5:8 | Memory Address | 0000 = FC000 - FDFFF | 0001 = F8000 - F9FFF | 0010 = F4000 - F5FFF | 0011 = F0000 - F1FFF | 0100 = EC000 - EDFFF | 0101 = E8000 - E9FFF | 0110 = E4000 - E5FFF | 0111 = E0000 - E1FFF | 1000 = DC000 - DDFFF | 1001 = D8000 - D9FFF | 1010 = D4000 - D5FFF | 1011 = D0000 - D1FFF* | 1100 = CC000 - CDFFF | 1101 = C8000 - C9FFF | 1110 = C4000 - C5FFF | 1111 = C0000 - C1FFF | 5678 | DIP_SW 1:4 | IO RANGE | 1 = ON | 0 = OFF | *Default Setting | 0000 = 3E0h | 0001 = 3C0h | 0010 = 3A0h | 0011 = 380h | 0100 = 360h | 0101 = 340h | 0110 = 320h | 0111 = 300h* | 1000 = 2E0h | 1001 = 2C0h | 1010 = 2A0h | 1011 = 280h | 1100 = 260h | 1101 = 240h | 1110 = 220h | 1111 = 200h | 1234
tNames: ROM WRITE ENABLE | ROM WRITE PROTECT | VCC | ROM ENABLE | ROM DISABLE | GND | TCK | TDO | TDI | TMS | JTAG
Reference: XT-IDE ADAPTER | CC-BY-SA v1b | http://dangerousprototypes.com